# Altium schematic sheet ADC_IN.SchDoc
size D
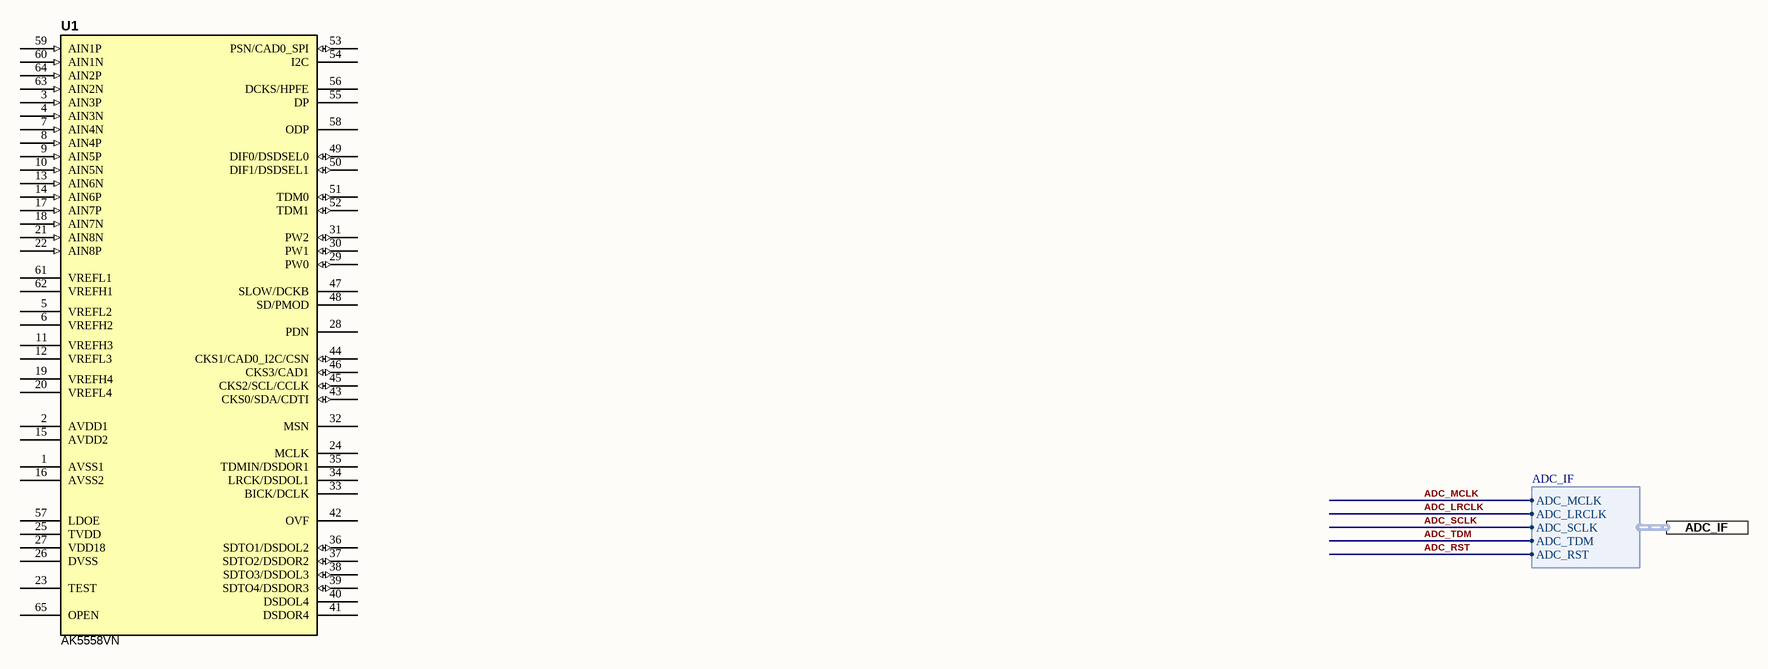
[diagram p0: ADC_IN.SchDoc]

## Parts
U1  AK5558VN  [AK5558VN]

## Ports
ADC_IF (harness ADC_IF)

## Harnesses
ADC_IF: ADC_MCLK, ADC_LRCLK, ADC_SCLK, ADC_TDM, ADC_RST

## Nets
ADC_LRCLK: port ADC_IF.ADC_LRCLK
ADC_MCLK: port ADC_IF.ADC_MCLK
ADC_RST: port ADC_IF.ADC_RST
ADC_SCLK: port ADC_IF.ADC_SCLK
ADC_TDM: port ADC_IF.ADC_TDM

Not connected (* = marked no-connect by the designer): U1 1(AVSS1) 2(AVDD1) 3(AIN3P) 4(AIN3N) 5(VREFL2) 6(VREFH2) 7(AIN4N) 8(AIN4P) 9(AIN5P) 10(AIN5N) 11(VREFH3) 12(VREFL3) 13(AIN6N) 14(AIN6P) 15(AVDD2) 16(AVSS2) 17(AIN7P) 18(AIN7N) 19(VREFH4) 20(VREFL4) 21(AIN8N) 22(AIN8P) 23(TEST) 24(MCLK) 25(TVDD) 26(DVSS) 27(VDD18) 28(PDN) 29(PW0) 30(PW1) 31(PW2) 32(MSN) 33(BICK/DCLK) 34(LRCK/DSDOL1) 35(TDMIN/DSDOR1) 36(SDTO1/DSDOL2) 37(SDTO2/DSDOR2) 38(SDTO3/DSDOL3) 39(SDTO4/DSDOR3) 40(DSDOL4) 41(DSDOR4) 42(OVF) 43(CKS0/SDA/CDTI) 44(CKS1/CAD0_I2C/CSN) 45(CKS2/SCL/CCLK) 46(CKS3/CAD1) 47(SLOW/DCKB) 48(SD/PMOD) 49(DIF0/DSDSEL0) 50(DIF1/DSDSEL1) 51(TDM0) 52(TDM1) 53(PSN/CAD0_SPI) 54(I2C) 55(DP) 56(DCKS/HPFE) 57(LDOE) 58(ODP) 59(AIN1P) 60(AIN1N) 61(VREFL1) 62(VREFH1) 63(AIN2N) 64(AIN2P) 65(OPEN)

## Notes on the sheet
- Title
- Size:
- Date:
- File:
- D
- Number:
- Time:
- Revision:
- Sheet
- of

## Library data of the parts
U1 = AK5558VN: IC ADC, Audio 32 bit 768k DSD, PCM 64-QFN (9x9); Manufacturer: AKM/Asahi Kasei Microdevices; Manufacturer Part Number: AK5558VN; Type: DEV; Category: ADCs/DACs - Special Purpose; Supplier Device Package: 64-QFN (9x9); Mounting Type: Surface Mount